# Altium schematic sheet Sheet_1_2024-11-01.schdoc
size 730 x 258 mm
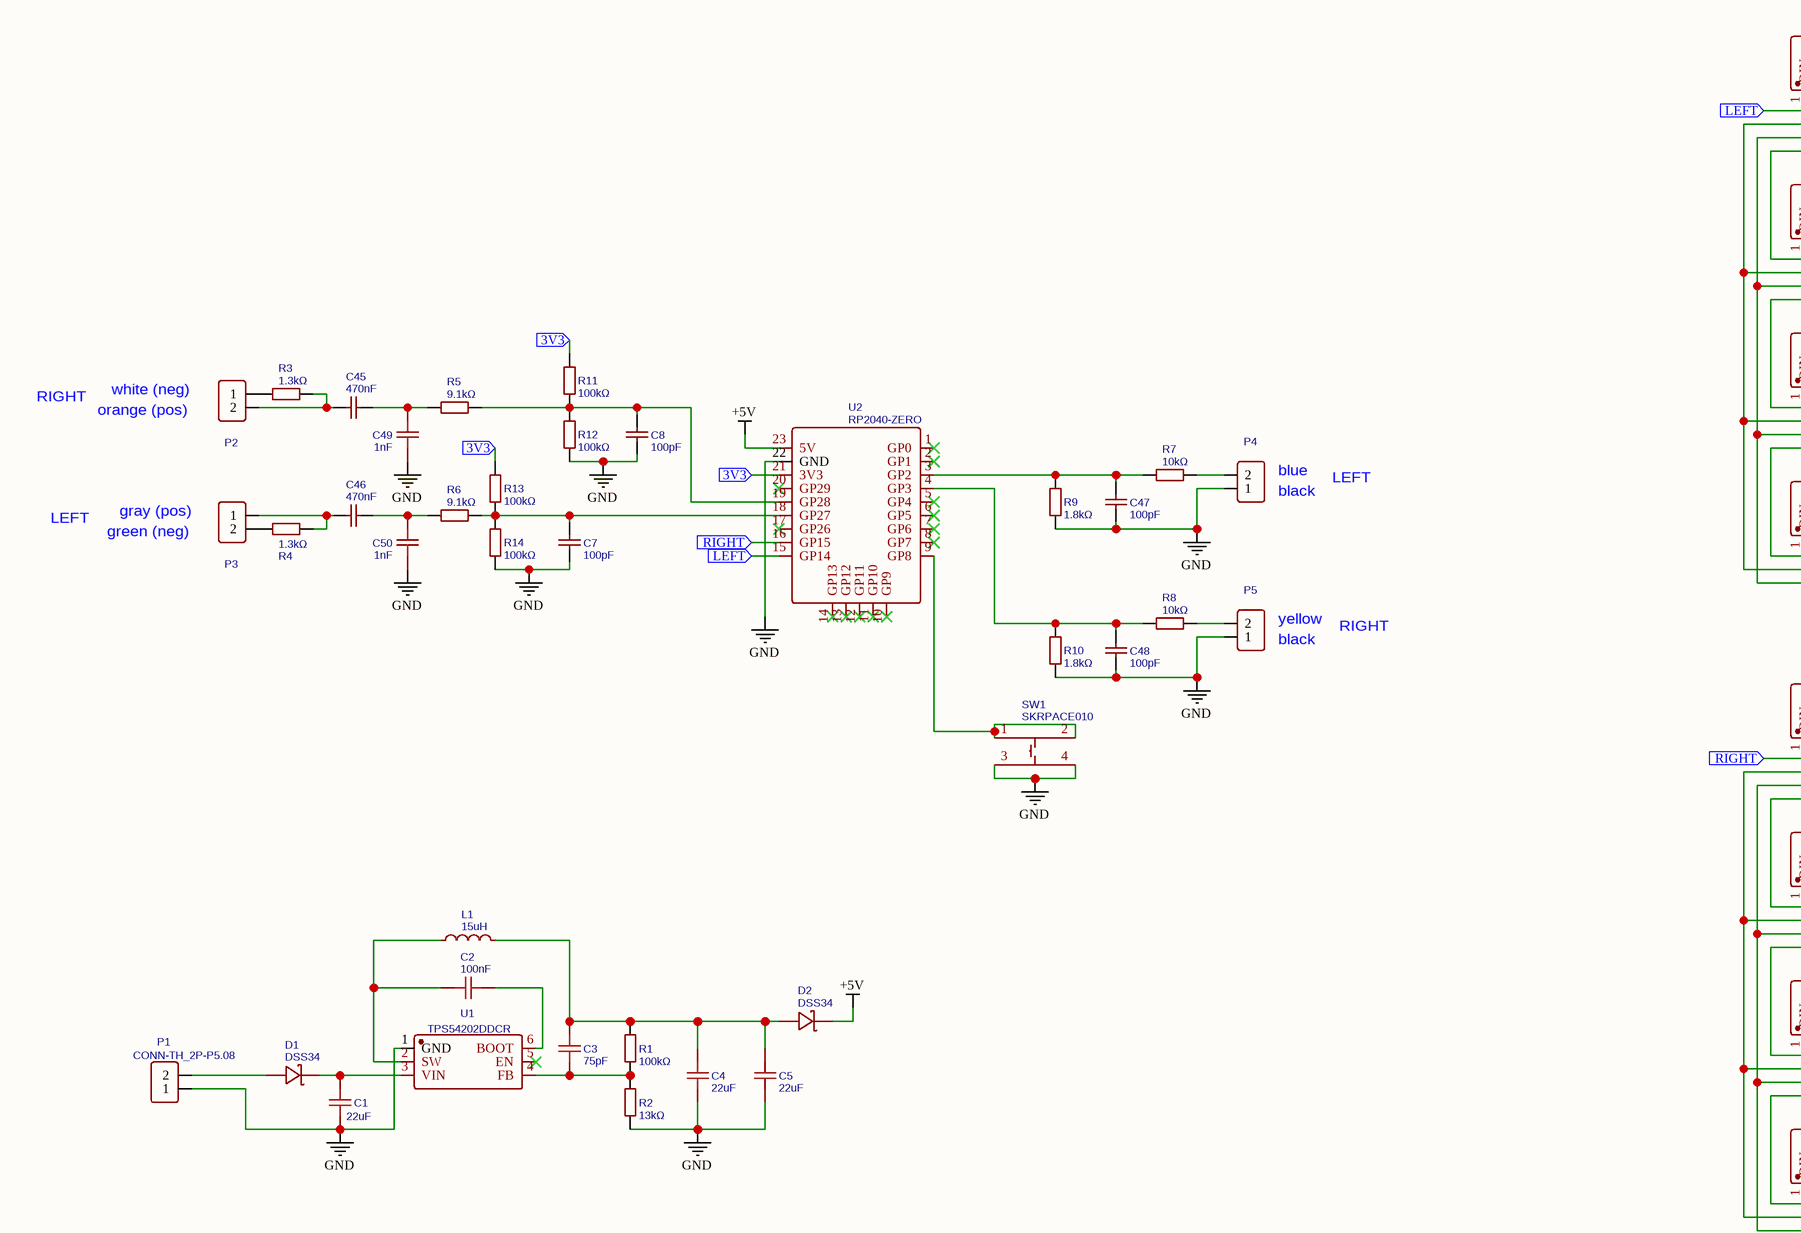
[diagram p0: Sheet_1_2024-11-01.schdoc, left]
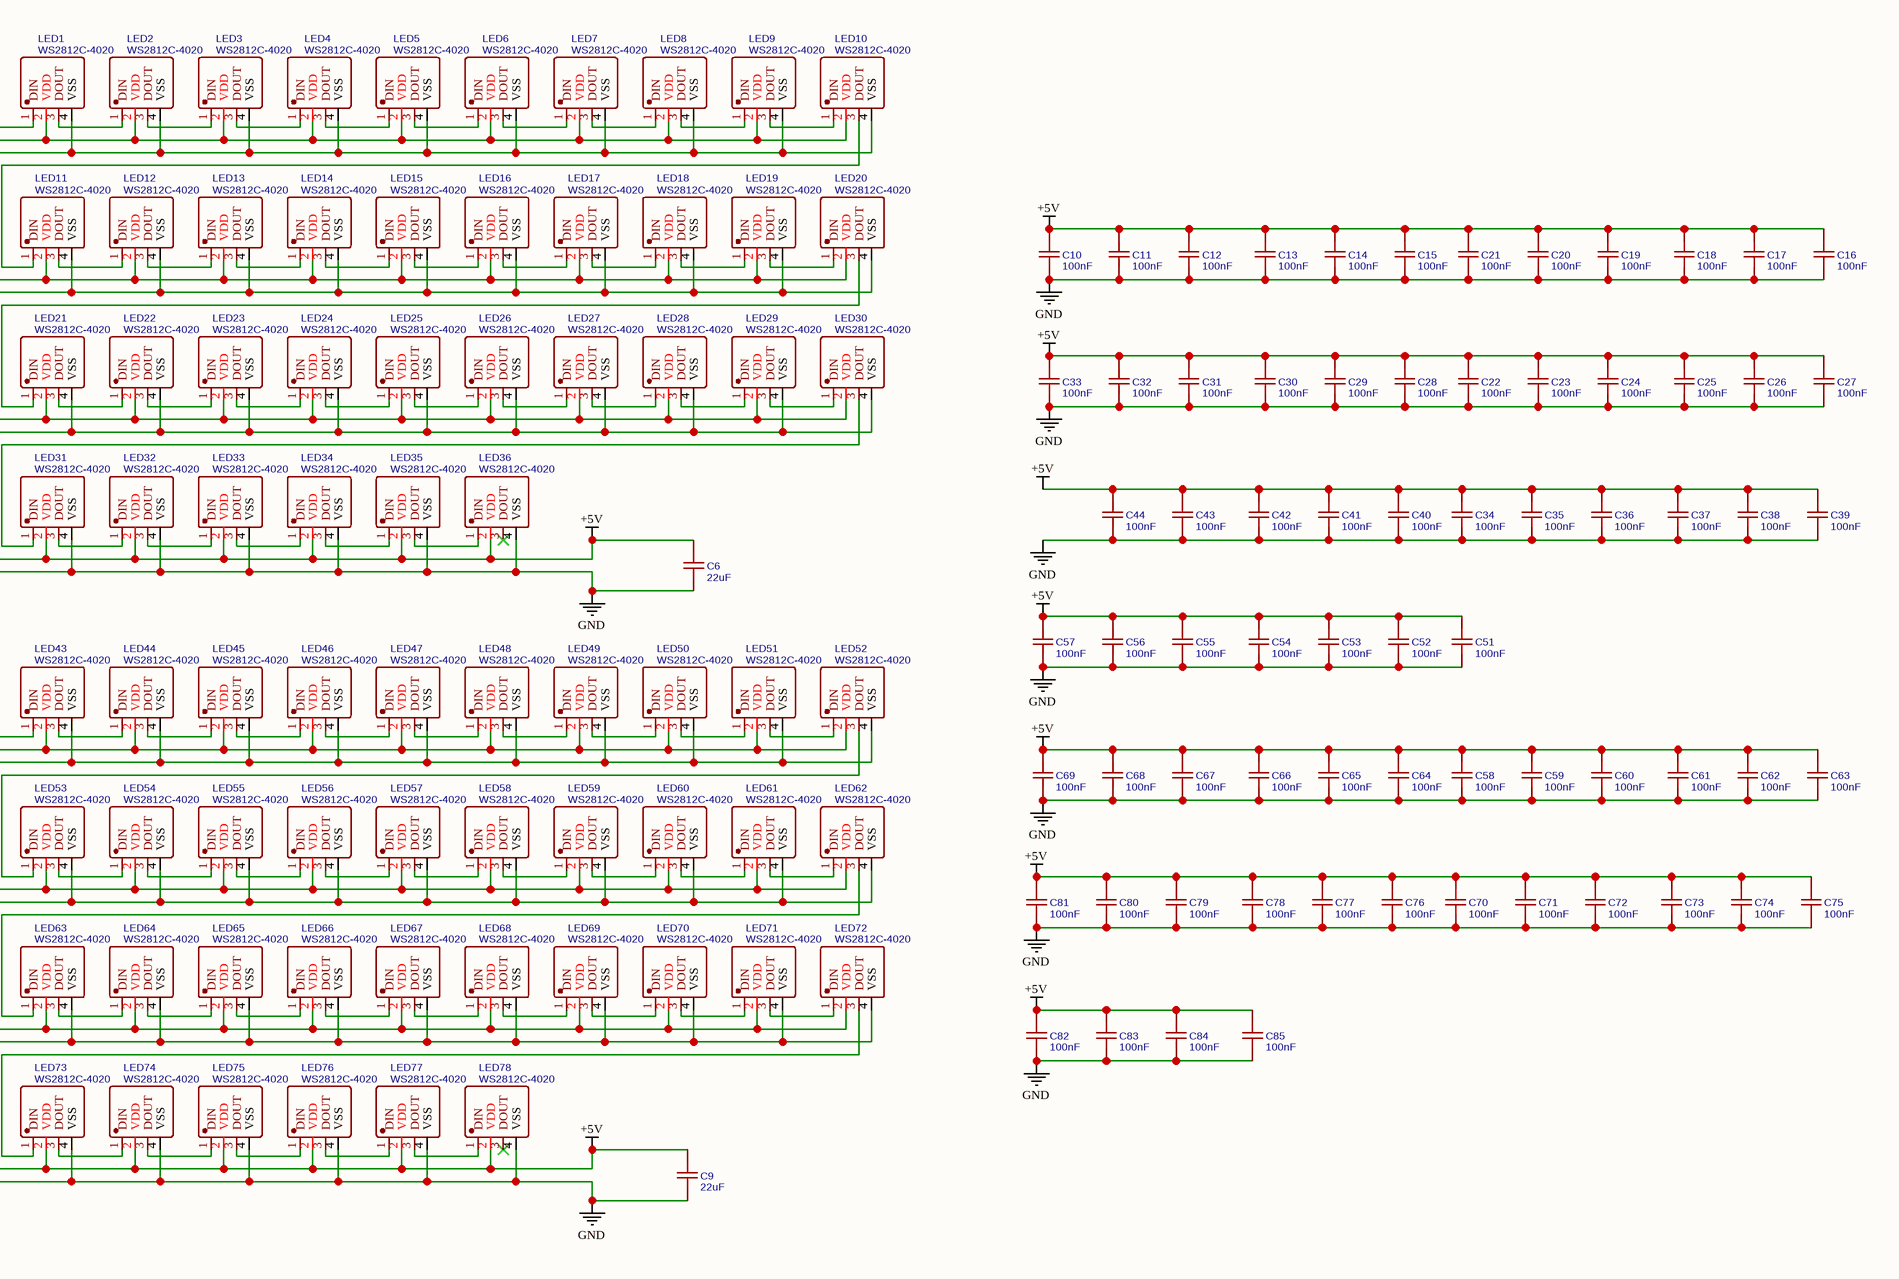
[diagram p1: Sheet_1_2024-11-01.schdoc, right]

## Parts
C1  22uF  [C0805]
C2  100nF  [C0402]
C3  75pF  [C0603]
C4  22uF  [C0603]
C5  22uF  [C0603]
C6  22uF  [C0603]
C7  100pF  [C0603]
C8  100pF  [C0603]
C9  22uF  [C0603]
C10  100nF  [C0402]
C11  100nF  [C0402]
C12  100nF  [C0402]
C13  100nF  [C0402]
C14  100nF  [C0402]
C15  100nF  [C0402]
C16  100nF  [C0402]
C17  100nF  [C0402]
C18  100nF  [C0402]
C19  100nF  [C0402]
C20  100nF  [C0402]
C21  100nF  [C0402]
C22  100nF  [C0402]
C23  100nF  [C0402]
C24  100nF  [C0402]
C25  100nF  [C0402]
C26  100nF  [C0402]
C27  100nF  [C0402]
C28  100nF  [C0402]
C29  100nF  [C0402]
C30  100nF  [C0402]
C31  100nF  [C0402]
C32  100nF  [C0402]
C33  100nF  [C0402]
C34  100nF  [C0402]
C35  100nF  [C0402]
C36  100nF  [C0402]
C37  100nF  [C0402]
C38  100nF  [C0402]
C39  100nF  [C0402]
C40  100nF  [C0402]
C41  100nF  [C0402]
C42  100nF  [C0402]
C43  100nF  [C0402]
C44  100nF  [C0402]
C45  470nF  [C0805]
C46  470nF  [C0805]
C47  100pF  [C0603]
C48  100pF  [C0603]
C49  1nF  [C0603]
C50  1nF  [C0603]
C51  100nF  [C0402]
C52  100nF  [C0402]
C53  100nF  [C0402]
C54  100nF  [C0402]
C55  100nF  [C0402]
C56  100nF  [C0402]
C57  100nF  [C0402]
C58  100nF  [C0402]
C59  100nF  [C0402]
C60  100nF  [C0402]
C61  100nF  [C0402]
C62  100nF  [C0402]
C63  100nF  [C0402]
C64  100nF  [C0402]
C65  100nF  [C0402]
C66  100nF  [C0402]
C67  100nF  [C0402]
C68  100nF  [C0402]
C69  100nF  [C0402]
C70  100nF  [C0402]
C71  100nF  [C0402]
C72  100nF  [C0402]
C73  100nF  [C0402]
C74  100nF  [C0402]
C75  100nF  [C0402]
C76  100nF  [C0402]
C77  100nF  [C0402]
C78  100nF  [C0402]
C79  100nF  [C0402]
C80  100nF  [C0402]
C81  100nF  [C0402]
C82  100nF  [C0402]
C83  100nF  [C0402]
C84  100nF  [C0402]
C85  100nF  [C0402]
D1  DSS34  [SOD-123_L2.8-W1.8-LS3.7-RD]
D2  DSS34  [SOD-123_L2.8-W1.8-LS3.7-RD]
L1  15uH  [IND-SMD_L6.0-W6.0_CDRH5D18BHPNP]
LED1  WS2812C-4020  [LED-SMD_4P-L4.0-W1.7-R]
LED2  WS2812C-4020  [LED-SMD_4P-L4.0-W1.7-R]
LED3  WS2812C-4020  [LED-SMD_4P-L4.0-W1.7-R]
LED4  WS2812C-4020  [LED-SMD_4P-L4.0-W1.7-R]
LED5  WS2812C-4020  [LED-SMD_4P-L4.0-W1.7-R]
LED6  WS2812C-4020  [LED-SMD_4P-L4.0-W1.7-R]
LED7  WS2812C-4020  [LED-SMD_4P-L4.0-W1.7-R]
LED8  WS2812C-4020  [LED-SMD_4P-L4.0-W1.7-R]
LED9  WS2812C-4020  [LED-SMD_4P-L4.0-W1.7-R]
LED10  WS2812C-4020  [LED-SMD_4P-L4.0-W1.7-R]
LED11  WS2812C-4020  [LED-SMD_4P-L4.0-W1.7-R]
LED12  WS2812C-4020  [LED-SMD_4P-L4.0-W1.7-R]
LED13  WS2812C-4020  [LED-SMD_4P-L4.0-W1.7-R]
LED14  WS2812C-4020  [LED-SMD_4P-L4.0-W1.7-R]
LED15  WS2812C-4020  [LED-SMD_4P-L4.0-W1.7-R]
LED16  WS2812C-4020  [LED-SMD_4P-L4.0-W1.7-R]
LED17  WS2812C-4020  [LED-SMD_4P-L4.0-W1.7-R]
LED18  WS2812C-4020  [LED-SMD_4P-L4.0-W1.7-R]
LED19  WS2812C-4020  [LED-SMD_4P-L4.0-W1.7-R]
LED20  WS2812C-4020  [LED-SMD_4P-L4.0-W1.7-R]
LED21  WS2812C-4020  [LED-SMD_4P-L4.0-W1.7-R]
LED22  WS2812C-4020  [LED-SMD_4P-L4.0-W1.7-R]
LED23  WS2812C-4020  [LED-SMD_4P-L4.0-W1.7-R]
LED24  WS2812C-4020  [LED-SMD_4P-L4.0-W1.7-R]
LED25  WS2812C-4020  [LED-SMD_4P-L4.0-W1.7-R]
LED26  WS2812C-4020  [LED-SMD_4P-L4.0-W1.7-R]
LED27  WS2812C-4020  [LED-SMD_4P-L4.0-W1.7-R]
LED28  WS2812C-4020  [LED-SMD_4P-L4.0-W1.7-R]
LED29  WS2812C-4020  [LED-SMD_4P-L4.0-W1.7-R]
LED30  WS2812C-4020  [LED-SMD_4P-L4.0-W1.7-R]
LED31  WS2812C-4020  [LED-SMD_4P-L4.0-W1.7-R]
LED32  WS2812C-4020  [LED-SMD_4P-L4.0-W1.7-R]
LED33  WS2812C-4020  [LED-SMD_4P-L4.0-W1.7-R]
LED34  WS2812C-4020  [LED-SMD_4P-L4.0-W1.7-R]
LED35  WS2812C-4020  [LED-SMD_4P-L4.0-W1.7-R]
LED36  WS2812C-4020  [LED-SMD_4P-L4.0-W1.7-R]
LED43  WS2812C-4020  [LED-SMD_4P-L4.0-W1.7-R]
LED44  WS2812C-4020  [LED-SMD_4P-L4.0-W1.7-R]
LED45  WS2812C-4020  [LED-SMD_4P-L4.0-W1.7-R]
LED46  WS2812C-4020  [LED-SMD_4P-L4.0-W1.7-R]
LED47  WS2812C-4020  [LED-SMD_4P-L4.0-W1.7-R]
LED48  WS2812C-4020  [LED-SMD_4P-L4.0-W1.7-R]
LED49  WS2812C-4020  [LED-SMD_4P-L4.0-W1.7-R]
LED50  WS2812C-4020  [LED-SMD_4P-L4.0-W1.7-R]
LED51  WS2812C-4020  [LED-SMD_4P-L4.0-W1.7-R]
LED52  WS2812C-4020  [LED-SMD_4P-L4.0-W1.7-R]
LED53  WS2812C-4020  [LED-SMD_4P-L4.0-W1.7-R]
LED54  WS2812C-4020  [LED-SMD_4P-L4.0-W1.7-R]
LED55  WS2812C-4020  [LED-SMD_4P-L4.0-W1.7-R]
LED56  WS2812C-4020  [LED-SMD_4P-L4.0-W1.7-R]
LED57  WS2812C-4020  [LED-SMD_4P-L4.0-W1.7-R]
LED58  WS2812C-4020  [LED-SMD_4P-L4.0-W1.7-R]
LED59  WS2812C-4020  [LED-SMD_4P-L4.0-W1.7-R]
LED60  WS2812C-4020  [LED-SMD_4P-L4.0-W1.7-R]
LED61  WS2812C-4020  [LED-SMD_4P-L4.0-W1.7-R]
LED62  WS2812C-4020  [LED-SMD_4P-L4.0-W1.7-R]
LED63  WS2812C-4020  [LED-SMD_4P-L4.0-W1.7-R]
LED64  WS2812C-4020  [LED-SMD_4P-L4.0-W1.7-R]
LED65  WS2812C-4020  [LED-SMD_4P-L4.0-W1.7-R]
LED66  WS2812C-4020  [LED-SMD_4P-L4.0-W1.7-R]
LED67  WS2812C-4020  [LED-SMD_4P-L4.0-W1.7-R]
LED68  WS2812C-4020  [LED-SMD_4P-L4.0-W1.7-R]
LED69  WS2812C-4020  [LED-SMD_4P-L4.0-W1.7-R]
LED70  WS2812C-4020  [LED-SMD_4P-L4.0-W1.7-R]
LED71  WS2812C-4020  [LED-SMD_4P-L4.0-W1.7-R]
LED72  WS2812C-4020  [LED-SMD_4P-L4.0-W1.7-R]
LED73  WS2812C-4020  [LED-SMD_4P-L4.0-W1.7-R]
LED74  WS2812C-4020  [LED-SMD_4P-L4.0-W1.7-R]
LED75  WS2812C-4020  [LED-SMD_4P-L4.0-W1.7-R]
LED76  WS2812C-4020  [LED-SMD_4P-L4.0-W1.7-R]
LED77  WS2812C-4020  [LED-SMD_4P-L4.0-W1.7-R]
LED78  WS2812C-4020  [LED-SMD_4P-L4.0-W1.7-R]
P1  CONN-TH_2P-P5.08  [CONN-TH_2P-P5.08]
P2  CONN-TH_2P-P5.08  [CONN-TH_2P-P5.08]  (value not drawn)
P3  CONN-TH_2P-P5.08  [CONN-TH_2P-P5.08]  (value not drawn)
P4  CONN-TH_2P-P5.08  [CONN-TH_2P-P5.08]  (value not drawn)
P5  CONN-TH_2P-P5.08  [CONN-TH_2P-P5.08]  (value not drawn)
R1  100kΩ  [R0603]
R2  13kΩ  [R0603]
R3  1.3kΩ  [R0603]
R4  1.3kΩ  [R0603]
R5  9.1kΩ  [R0603]
R6  9.1kΩ  [R0603]
R7  10kΩ  [R0603]
R8  10kΩ  [R0603]
R9  1.8kΩ  [R0603]
R10  1.8kΩ  [R0603]
R11  100kΩ  [R0603]
R12  100kΩ  [R0603]
R13  100kΩ  [R0603]
R14  100kΩ  [R0603]
SW1  SKRPACE010  [KEY-SMD_4P-L4.2-W3.2-P2.20-LS4.6]
U1  TPS54202DDCR  [SOT-23-6_L2.9-W1.6-P0.95-LS2.8-BL]
U2  RP2040-ZERO  [COMM-SMD_RP2040-ZERO]

## Ports
3V3 (in), LEFT (in), RIGHT (in)

## Nets
+5V: C6.2 C9.2 C10.2 C11.2 C12.2 C13.2 C14.2 C15.2 C16.2 C17.2 C18.2 C19.2 C20.2 C21.2 C22.2 C23.2 C24.2 C25.2 C26.2 C27.2 C28.2 C29.2 C30.2 C31.2 C32.2 C33.2 C34.2 C35.2 C36.2 C37.2 C38.2 C39.2 C40.2 C41.2 C42.2 C43.2 C44.2 C51.2 C52.2 C53.2 C54.2 C55.2 C56.2 C57.2 C58.2 C59.2 C60.2 C61.2 C62.2 C63.2 C64.2 C65.2 C66.2 C67.2 C68.2 C69.2 C70.2 C71.2 C72.2 C73.2 C74.2 C75.2 C76.2 C77.2 C78.2 C79.2 C80.2 C81.2 C82.2 C83.2 C84.2 C85.2 D2.1(K) LED1.2(VDD) LED2.2(VDD) LED3.2(VDD) LED4.2(VDD) LED5.2(VDD) LED6.2(VDD) LED7.2(VDD) LED8.2(VDD) LED9.2(VDD) LED10.2(VDD) LED11.2(VDD) LED12.2(VDD) LED13.2(VDD) LED14.2(VDD) LED15.2(VDD) LED16.2(VDD) LED17.2(VDD) LED18.2(VDD) LED19.2(VDD) LED20.2(VDD) LED21.2(VDD) LED22.2(VDD) LED23.2(VDD) LED24.2(VDD) LED25.2(VDD) LED26.2(VDD) LED27.2(VDD) LED28.2(VDD) LED29.2(VDD) LED30.2(VDD) LED31.2(VDD) LED32.2(VDD) LED33.2(VDD) LED34.2(VDD) LED35.2(VDD) LED36.2(VDD) LED43.2(VDD) LED44.2(VDD) LED45.2(VDD) LED46.2(VDD) LED47.2(VDD) LED48.2(VDD) LED49.2(VDD) LED50.2(VDD) LED51.2(VDD) LED52.2(VDD) LED53.2(VDD) LED54.2(VDD) LED55.2(VDD) LED56.2(VDD) LED57.2(VDD) LED58.2(VDD) LED59.2(VDD) LED60.2(VDD) LED61.2(VDD) LED62.2(VDD) LED63.2(VDD) LED64.2(VDD) LED65.2(VDD) LED66.2(VDD) LED67.2(VDD) LED68.2(VDD) LED69.2(VDD) LED70.2(VDD) LED71.2(VDD) LED72.2(VDD) LED73.2(VDD) LED74.2(VDD) LED75.2(VDD) LED76.2(VDD) LED77.2(VDD) LED78.2(VDD) U2.23(5V)
GND: C1.1 C4.1 C5.1 C6.1 C7.1 C8.1 C9.1 C10.1 C11.1 C12.1 C13.1 C14.1 C15.1 C16.1 C17.1 C18.1 C19.1 C20.1 C21.1 C22.1 C23.1 C24.1 C25.1 C26.1 C27.1 C28.1 C29.1 C30.1 C31.1 C32.1 C33.1 C34.1 C35.1 C36.1 C37.1 C38.1 C39.1 C40.1 C41.1 C42.1 C43.1 C44.1 C47.1 C48.1 C49.2 C50.2 C51.1 C52.1 C53.1 C54.1 C55.1 C56.1 C57.1 C58.1 C59.1 C60.1 C61.1 C62.1 C63.1 C64.1 C65.1 C66.1 C67.1 C68.1 C69.1 C70.1 C71.1 C72.1 C73.1 C74.1 C75.1 C76.1 C77.1 C78.1 C79.1 C80.1 C81.1 C82.1 C83.1 C84.1 C85.1 LED1.4(VSS) LED2.4(VSS) LED3.4(VSS) LED4.4(VSS) LED5.4(VSS) LED6.4(VSS) LED7.4(VSS) LED8.4(VSS) LED9.4(VSS) LED10.4(VSS) LED11.4(VSS) LED12.4(VSS) LED13.4(VSS) LED14.4(VSS) LED15.4(VSS) LED16.4(VSS) LED17.4(VSS) LED18.4(VSS) LED19.4(VSS) LED20.4(VSS) LED21.4(VSS) LED22.4(VSS) LED23.4(VSS) LED24.4(VSS) LED25.4(VSS) LED26.4(VSS) LED27.4(VSS) LED28.4(VSS) LED29.4(VSS) LED30.4(VSS) LED31.4(VSS) LED32.4(VSS) LED33.4(VSS) LED34.4(VSS) LED35.4(VSS) LED36.4(VSS) LED43.4(VSS) LED44.4(VSS) LED45.4(VSS) LED46.4(VSS) LED47.4(VSS) LED48.4(VSS) LED49.4(VSS) LED50.4(VSS) LED51.4(VSS) LED52.4(VSS) LED53.4(VSS) LED54.4(VSS) LED55.4(VSS) LED56.4(VSS) LED57.4(VSS) LED58.4(VSS) LED59.4(VSS) LED60.4(VSS) LED61.4(VSS) LED62.4(VSS) LED63.4(VSS) LED64.4(VSS) LED65.4(VSS) LED66.4(VSS) LED67.4(VSS) LED68.4(VSS) LED69.4(VSS) LED70.4(VSS) LED71.4(VSS) LED72.4(VSS) LED73.4(VSS) LED74.4(VSS) LED75.4(VSS) LED76.4(VSS) LED77.4(VSS) LED78.4(VSS) P1.1 P4.1 P5.1 R2.1 R9.1 R10.1 R12.1 R14.1 SW1.3 SW1.4 U1.1(GND) U2.22(GND)
3V3: R11.2 R13.2 U2.21(3V3) ; port 3V3
LEFT: LED1.1(DIN) U2.15(GP14) ; port LEFT
RIGHT: LED43.1(DIN) U2.16(GP15) ; port RIGHT
NetC1_2: C1.2 D1.1(K) U1.3(VIN)
NetC2_1: C2.1 U1.6(BOOT)
NetC2_2: C2.2 L1.1 U1.2(SW)
NetC3_1: C3.1 R1.1 R2.2 U1.4(FB)
NetC3_2: C3.2 C4.2 C5.2 D2.2(A) L1.2 R1.2
NetC7_2: C7.2 R6.2 R13.1 R14.2 U2.18(GP27)
NetC8_2: C8.2 R5.2 R11.1 R12.2 U2.19(GP28)
NetC45_1: C45.1 P2.2 R3.2
NetC45_2: C45.2 C49.1 R5.1
NetC46_1: C46.1 P3.1 R4.2
NetC46_2: C46.2 C50.1 R6.1
NetC47_2: C47.2 R7.1 R9.2 U2.3(GP2)
NetC48_2: C48.2 R8.1 R10.2 U2.4(GP3)
NetD1_2: D1.2(A) P1.2
NetLED1_3: LED1.3(DOUT) LED2.1(DIN)
NetLED2_3: LED2.3(DOUT) LED3.1(DIN)
NetLED3_3: LED3.3(DOUT) LED4.1(DIN)
NetLED4_3: LED4.3(DOUT) LED5.1(DIN)
NetLED5_3: LED5.3(DOUT) LED6.1(DIN)
NetLED6_3: LED6.3(DOUT) LED7.1(DIN)
NetLED7_3: LED7.3(DOUT) LED8.1(DIN)
NetLED8_3: LED8.3(DOUT) LED9.1(DIN)
NetLED9_3: LED9.3(DOUT) LED10.1(DIN)
NetLED10_3: LED10.3(DOUT) LED11.1(DIN)
NetLED11_3: LED11.3(DOUT) LED12.1(DIN)
NetLED12_3: LED12.3(DOUT) LED13.1(DIN)
NetLED13_3: LED13.3(DOUT) LED14.1(DIN)
NetLED14_3: LED14.3(DOUT) LED15.1(DIN)
NetLED15_3: LED15.3(DOUT) LED16.1(DIN)
NetLED16_3: LED16.3(DOUT) LED17.1(DIN)
NetLED17_3: LED17.3(DOUT) LED18.1(DIN)
NetLED18_3: LED18.3(DOUT) LED19.1(DIN)
NetLED19_3: LED19.3(DOUT) LED20.1(DIN)
NetLED20_3: LED20.3(DOUT) LED21.1(DIN)
NetLED21_3: LED21.3(DOUT) LED22.1(DIN)
NetLED22_3: LED22.3(DOUT) LED23.1(DIN)
NetLED23_3: LED23.3(DOUT) LED24.1(DIN)
NetLED24_3: LED24.3(DOUT) LED25.1(DIN)
NetLED25_3: LED25.3(DOUT) LED26.1(DIN)
NetLED26_3: LED26.3(DOUT) LED27.1(DIN)
NetLED27_3: LED27.3(DOUT) LED28.1(DIN)
NetLED28_3: LED28.3(DOUT) LED29.1(DIN)
NetLED29_3: LED29.3(DOUT) LED30.1(DIN)
NetLED30_3: LED30.3(DOUT) LED31.1(DIN)
NetLED31_3: LED31.3(DOUT) LED32.1(DIN)
NetLED32_3: LED32.3(DOUT) LED33.1(DIN)
NetLED33_3: LED33.3(DOUT) LED34.1(DIN)
NetLED34_3: LED34.3(DOUT) LED35.1(DIN)
NetLED35_3: LED35.3(DOUT) LED36.1(DIN)
NetLED43_3: LED43.3(DOUT) LED44.1(DIN)
NetLED44_3: LED44.3(DOUT) LED45.1(DIN)
NetLED45_3: LED45.3(DOUT) LED46.1(DIN)
NetLED46_3: LED46.3(DOUT) LED47.1(DIN)
NetLED47_3: LED47.3(DOUT) LED48.1(DIN)
NetLED48_3: LED48.3(DOUT) LED49.1(DIN)
NetLED49_3: LED49.3(DOUT) LED50.1(DIN)
NetLED50_3: LED50.3(DOUT) LED51.1(DIN)
NetLED51_3: LED51.3(DOUT) LED52.1(DIN)
NetLED52_3: LED52.3(DOUT) LED53.1(DIN)
NetLED53_3: LED53.3(DOUT) LED54.1(DIN)
NetLED54_3: LED54.3(DOUT) LED55.1(DIN)
NetLED55_3: LED55.3(DOUT) LED56.1(DIN)
NetLED56_3: LED56.3(DOUT) LED57.1(DIN)
NetLED57_3: LED57.3(DOUT) LED58.1(DIN)
NetLED58_3: LED58.3(DOUT) LED59.1(DIN)
NetLED59_3: LED59.3(DOUT) LED60.1(DIN)
NetLED60_3: LED60.3(DOUT) LED61.1(DIN)
NetLED61_3: LED61.3(DOUT) LED62.1(DIN)
NetLED62_3: LED62.3(DOUT) LED63.1(DIN)
NetLED63_3: LED63.3(DOUT) LED64.1(DIN)
NetLED64_3: LED64.3(DOUT) LED65.1(DIN)
NetLED65_3: LED65.3(DOUT) LED66.1(DIN)
NetLED66_3: LED66.3(DOUT) LED67.1(DIN)
NetLED67_3: LED67.3(DOUT) LED68.1(DIN)
NetLED68_3: LED68.3(DOUT) LED69.1(DIN)
NetLED69_3: LED69.3(DOUT) LED70.1(DIN)
NetLED70_3: LED70.3(DOUT) LED71.1(DIN)
NetLED71_3: LED71.3(DOUT) LED72.1(DIN)
NetLED72_3: LED72.3(DOUT) LED73.1(DIN)
NetLED73_3: LED73.3(DOUT) LED74.1(DIN)
NetLED74_3: LED74.3(DOUT) LED75.1(DIN)
NetLED75_3: LED75.3(DOUT) LED76.1(DIN)
NetLED76_3: LED76.3(DOUT) LED77.1(DIN)
NetLED77_3: LED77.3(DOUT) LED78.1(DIN)
NetP2_1: P2.1 R3.1
NetP3_2: P3.2 R4.1
NetP4_2: P4.2 R7.2
NetP5_2: P5.2 R8.2
NetSW1_1: SW1.1 SW1.2 U2.9(GP8)

Not connected (* = marked no-connect by the designer): LED36 3(DOUT)*; LED78 3(DOUT)*; U1 5(EN)*; U2 1(GP0)* 2(GP1)* 5(GP4)* 6(GP5)* 7(GP6)* 8(GP7)* 10(GP9)* 11(GP10)* 12(GP11)* 13(GP12)* 14(GP13)* 17(GP26)* 20(GP29)*

## Notes on the sheet
- RIGHT
- orange (pos)
- white (neg)
- (near P4) blue
- LEFT
- green (neg)
- gray (pos)
- (near P4) black
- (near P5) black
- (near P5) yellow

## Library data of the parts
C1 = 22uF: Manufacturer: Samsung Electro-Mechanics; Manufacturer Part: CL21A226MAYNNNE; nameAlias: Capacitance; Contributor: LCSC; Supplier: LCSC; Supplier Part: C602037; JLCPCB Part Class: Extended Part; spicePre: C; spiceSymbolName: CL21A226MAYNNNE
C2 C10-C44 C51-C85 = 100nF: Manufacturer Part: CL05B104KO5NNNC; Manufacturer: SAMSUNG(三星); nameAlias: Value; Supplier: LCSC; Supplier Part: C1525; JLCPCB Part Class: Basic Part; spicePre: C; spiceSymbolName: CL05B104KO5NNNC
C3 = 75pF: Manufacturer: YAGEO(国巨); Manufacturer Part: CC0603JRNPO9BN750; nameAlias: Value; Contributor: LCSC; Supplier: LCSC; Supplier Part: C282074; JLCPCB Part Class: Extended Part; spicePre: C; spiceSymbolName: CC0603JRNPO9BN750
C4-C6 C9 = 22uF: Manufacturer: SAMSUNG; Manufacturer Part: CL10A226MQ8NRNC; nameAlias: Capacitance; Package Display: No; Supplier: LCSC; Supplier Part: C59461; JLCPCB Part Class: Basic Part; spicePre: C; spiceSymbolName: CL10A226MQ8NRNC
C7 C8 C47 C48 = 100pF: Manufacturer Part: CL10C101JB8NNNC; Manufacturer: SAMSUNG(三星); nameAlias: Value; Supplier: LCSC; Supplier Part: C14858; JLCPCB Part Class: Basic Part; spicePre: C; spiceSymbolName: CL10C101JB8NNNC
C45 C46 = 470nF: Manufacturer Part: CL21B474KBFNNNE; Manufacturer: SAMSUNG(三星); nameAlias: Value; Supplier: LCSC; Supplier Part: C13967; JLCPCB Part Class: Basic Part; spicePre: C; spiceSymbolName: CL21B474KBFNNNE
C49 C50 = 1nF: Manufacturer: SAMSUNG(三星); Manufacturer Part: CL10C102JB8NNNC; nameAlias: Value; Contributor: LCSC; Supplier: LCSC; Supplier Part: C163508; JLCPCB Part Class: Extended Part; spicePre: C; spiceSymbolName: CL10C102JB8NNNC
D1 D2 = DSS34: Manufacturer: STARSEA; Supplier: LCSC; Manufacturer Part: DSS34; Supplier Part: C84632; JLCPCB Part Class: Extended Part; spicePre: D; spiceSymbolName: DSS34
L1 = 15uH: Manufacturer: Sunltech(韩国顺磁); Manufacturer Part: SLP6028S150MTT; nameAlias: Value; Contributor: LCSC; Supplier: LCSC; Supplier Part: C254863; JLCPCB Part Class: Extended Part; spicePre: L; spiceSymbolName: SLP6028S150MTT
LED1-LED36 LED43-LED78 = WS2812C-4020: Manufacturer: worldsemi; Contributor: lcsc; Supplier: LCSC; Supplier Part: C4154870; Manufacturer Part: WS2812C-4020; spicePre: L; spiceSymbolName: WS2812C-4020
P1-P5 = CONN-TH_2P-P5.08: Contributor: LCEDA_Lib; Supplier: LCSC; spicePre: P; spiceSymbolName: CONN-TH_2P-P5.08
R1 R11-R14 = 100kΩ: Manufacturer: UNI-ROYAL(厚声); Manufacturer Part: 0603WAF1003T5E; nameAlias: Value; Supplier: LCSC; Supplier Part: C25803; JLCPCB Part Class: Basic Part; spicePre: R; spiceSymbolName: 0603WAF1003T5E
R2 = 13kΩ: Manufacturer: UNI-ROYAL(厚声); Manufacturer Part: 0603WAF1302T5E; nameAlias: Value; Supplier: LCSC; Supplier Part: C22797; JLCPCB Part Class: Basic Part; spicePre: R; spiceSymbolName: 0603WAF1302T5E
R3 R4 = 1.3kΩ: Manufacturer: UNI-ROYAL(厚声); Manufacturer Part: 0603WAF1301T5E; nameAlias: Value; Supplier: LCSC; Supplier Part: C22767; JLCPCB Part Class: Extended Part; spicePre: R; spiceSymbolName: 0603WAF1301T5E
R5 R6 = 9.1kΩ: Manufacturer: UNI-ROYAL(厚声); Manufacturer Part: 0603WAF9101T5E; nameAlias: Value; Supplier: LCSC; Supplier Part: C23260; spicePre: R; spiceSymbolName: 0603WAF9101T5E
R7 R8 = 10kΩ: Manufacturer: UNI-ROYAL(厚声); Manufacturer Part: 0603WAF1002T5E; nameAlias: Value; Supplier: LCSC; Supplier Part: C25804; JLCPCB Part Class: Basic Part; spicePre: R; spiceSymbolName: 0603WAF1002T5E
R9 R10 = 1.8kΩ: Manufacturer: UNI-ROYAL(厚声); Manufacturer Part: 0603WAF1801T5E; nameAlias: Value; Supplier: LCSC; Supplier Part: C4177; JLCPCB Part Class: Basic Part; spicePre: R; spiceSymbolName: 0603WAF1801T5E
SW1 = SKRPACE010: Manufacturer: ALPSALPINE(阿尔卑斯阿尔派); Contributor: LCSC; Supplier: LCSC; Manufacturer Part: SKRPACE010; Supplier Part: C139797; JLCPCB Part Class: Extended Part; spicePre: S; spiceSymbolName: SKRPACE010
U1 = TPS54202DDCR: Manufacturer: TI(德州仪器); Contributor: LCSC; Supplier: LCSC; Supplier Part: C191884; Manufacturer Part: TPS54202DDCR; JLCPCB Part Class: Extended Part; spicePre: U; spiceSymbolName: TPS54202DDCR
U2 = RP2040-ZERO: Manufacturer: Waveshare(微雪电子); Contributor: lcsc; Supplier: LCSC; Supplier Part: C5350143; Manufacturer Part: RP2040-Zero; JLCPCB Part Class: Extended Part; spicePre: U; spiceSymbolName: RP2040-ZERO